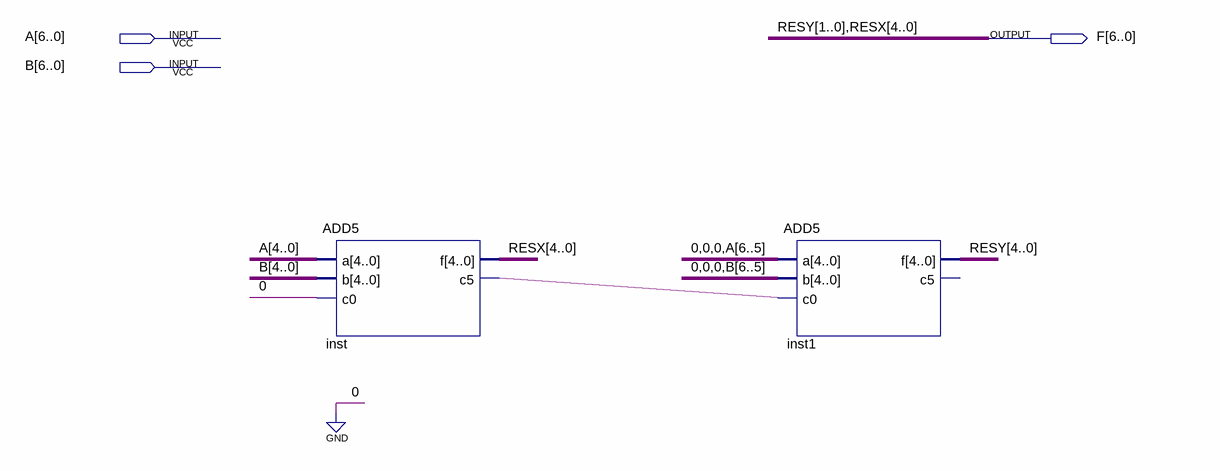
[diagram p0: schematic sheet]
// Quartus schematic ADD7.bdf as structural Verilog: 2 symbols, 3 pins
module ADD7 (
  input  [6:0] A,
  input  [6:0] B,
  output [6:0] F
);

  wire inst_c5;
  wire [4:2] RESY;

  ADD5 inst (.a(A[4:0]), .b(B[4:0]), .c0(1'b0), .f(F[4:0]), .c5(inst_c5));
  ADD5 inst1 (.a({3'b000, A[6:5]}), .b({3'b000, B[6:5]}), .c0(inst_c5), .f({RESY, F[6:5]}));  // open: c5

  // Other names for the same wires on the sheet: RESX[4:0] = F[4:0]; RESY[1:0] = F[6:5]
endmodule
